# EAGLE design TMotor_Rev0_5_1_Jan30 (EAGLE 9.6.2)

## Sheet 1 of 5: Arduino Nano Sense and Teensy
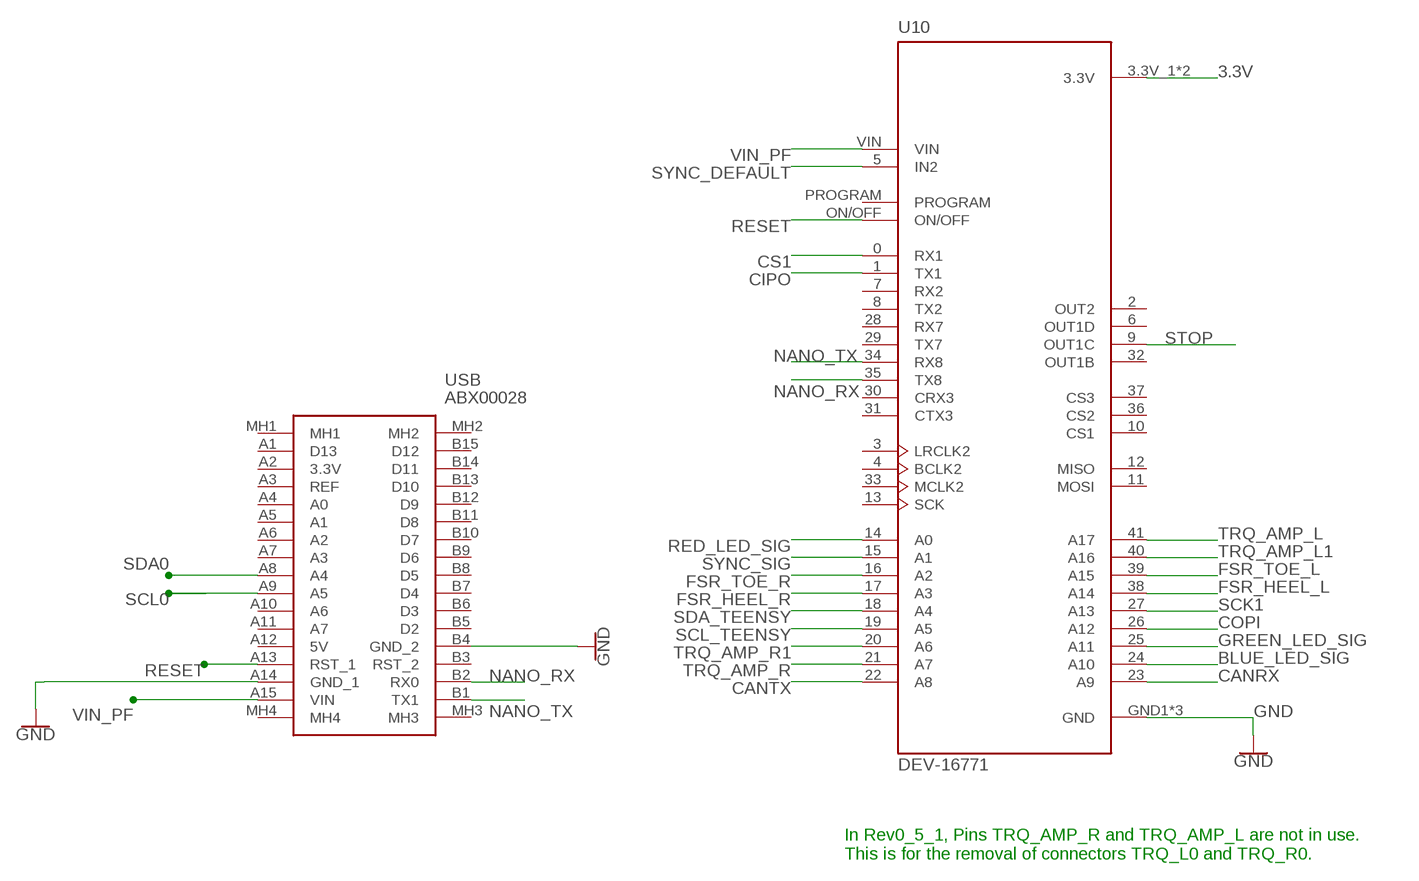
[diagram p0: schematic, sheet 1]

### Parts
U10  DEV-16771  [MODULE_DEV-16771]
USB  ABX00028  [ABX00028]

### Nets
3.3V: U10.3.3V_1(3.3V) U10.3.3V_2(3.3V) ; also sheet 2,4,5
BLUE_LED_SIG: U10.24(A10) ; also sheet 4
CANRX: U10.23(A9) ; also sheet 2
CANTX: U10.22(A8) ; also sheet 2
CIPO: U10.1(TX1) ; also sheet 2
COPI: U10.26(A12) ; also sheet 2
CS1: U10.0(RX1) ; also sheet 2
FSR_HEEL_L: U10.38(A14) ; also sheet 5
FSR_HEEL_R: U10.17(A3) ; also sheet 5
FSR_TOE_L: U10.39(A15) ; also sheet 5
FSR_TOE_R: U10.16(A2) ; also sheet 5
GND: U10.GND1(GND) U10.GND2(GND) U10.GND3(GND) USB.A14(GND_1) USB.B4(GND_2) ; also sheet 2,4,5
GREEN_LED_SIG: U10.25(A11) ; also sheet 4
NANO_RX: U10.35(TX8) USB.B2(RX0)
NANO_TX: U10.34(RX8) USB.B1(TX1)
RED_LED_SIG: U10.14(A0) ; also sheet 4
RESET: U10.ON/OFF USB.A13(RST_1) ; also sheet 2
SCK1: U10.27(A13) ; also sheet 2
SCL0: USB.A9(A5) ; also sheet 2
SCL_TEENSY: U10.19(A5) ; also sheet 2
SDA0: USB.A8(A4) ; also sheet 2
SDA_TEENSY: U10.18(A4) ; also sheet 2
STOP: U10.9(OUT1C) ; also sheet 2
SYNC_DEFAULT: U10.5(IN2) ; also sheet 2
SYNC_SIG: U10.15(A1) ; also sheet 4
TRQ_AMP_L: U10.41(A17)
TRQ_AMP_L1: U10.40(A16) ; also sheet 5
TRQ_AMP_R: U10.21(A7)
TRQ_AMP_R1: U10.20(A6) ; also sheet 5
VIN_PF: U10.VIN USB.A15(VIN) ; also sheet 2
Unconnected: U10.2(OUT2) U10.3(LRCLK2) U10.4(BCLK2) U10.6(OUT1D) U10.7(RX2) U10.8(TX2) U10.10(CS1) U10.11(MOSI) U10.12(MISO) U10.13(SCK) U10.28(RX7) U10.29(TX7) U10.30(CRX3) U10.31(CTX3) U10.32(OUT1B) U10.33(MCLK2) U10.36(CS2) U10.37(CS3) U10.PROGRAM USB.A1(D13) USB.A2(3.3V) USB.A3(REF) USB.A4(A0) USB.A5(A1) USB.A6(A2) USB.A7(A3) USB.A10(A6) USB.A11(A7) USB.A12(5V) USB.B3(RST_2) USB.B5(D2) USB.B6(D3) USB.B7(D4) USB.B8(D5) USB.B9(D6) USB.B10(D7) USB.B11(D8) USB.B12(D9) USB.B13(D10) USB.B14(D11) USB.B15(D12) USB.MH1 USB.MH2 USB.MH3 USB.MH4

### Notes on the sheet
- In Rev0_5_1, Pins TRQ_AMP_R and TRQ_AMP_L are not in use.
  This is for the removal of connectors TRQ_L0 and TRQ_R0.

## Sheet 2 of 5: Motor Drivers & Power
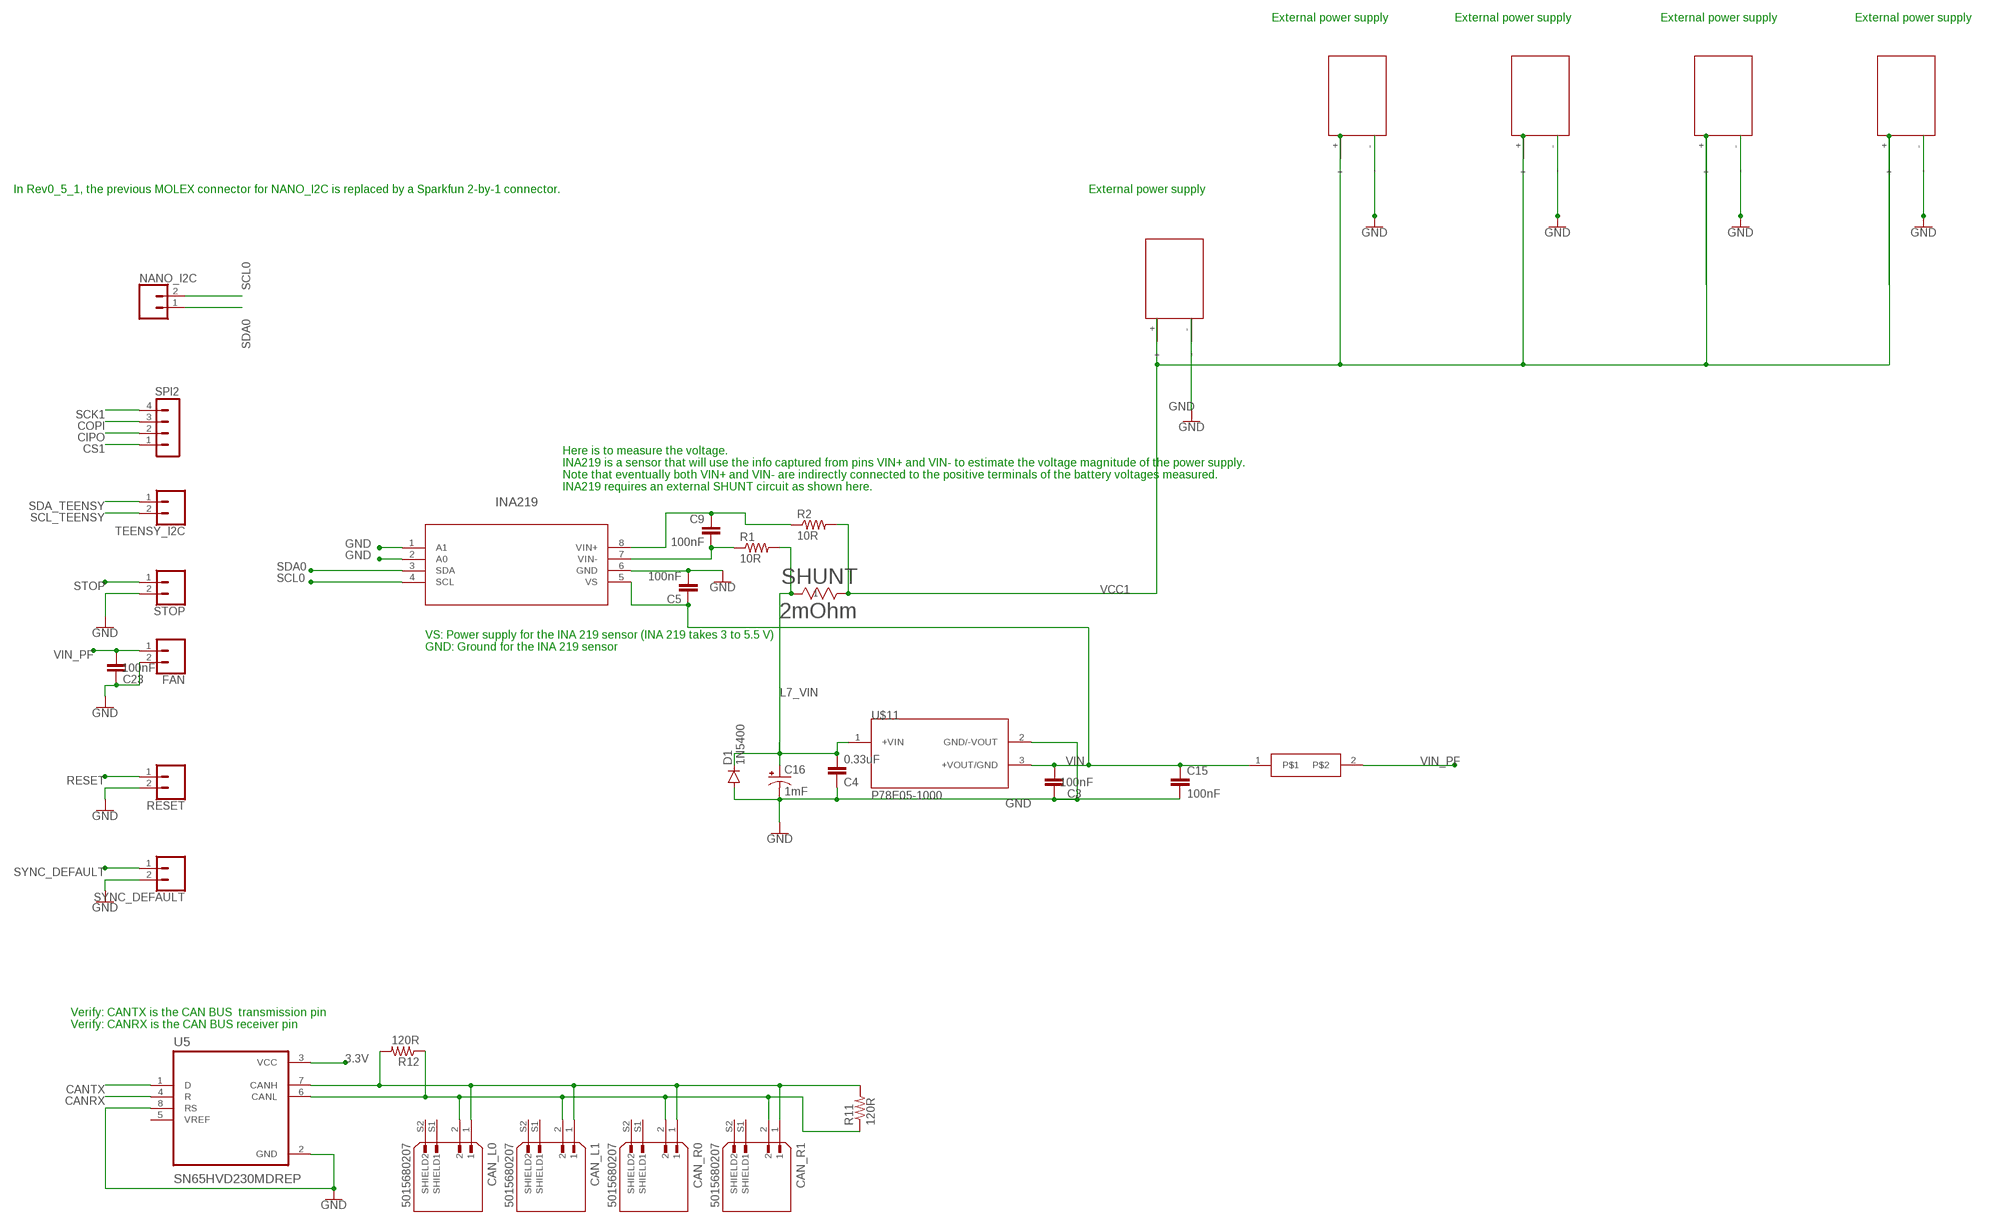
[diagram p1: schematic, sheet 2]

### Parts
C3  100nF  C-EU050-024X044  [C050-024X044]
C4  0.33uF  C-EU050-024X044  [C050-024X044]
C5  100nF  C-EU050-024X044  [C050-024X044]
C9  100nF  C-EU050-024X044  [C050-024X044]
C15  100nF  C-EU050-024X044  [C050-024X044]
C16  1mF  CPOL-USE5-10.5  [E5-10,5]
C23  100nF  C-EU050-024X044  [C050-024X044]
CAN_L0  5015680207  [MOLEX_5015680207]
CAN_L1  5015680207  [MOLEX_5015680207]
CAN_R0  5015680207  [MOLEX_5015680207]
CAN_R1  5015680207  [MOLEX_5015680207]
D1  1N5400  [DO201-15]
FAN  CONN_02  [1X02]
INA219  INA219AIDR  [D8_TEX]
NANO_I2C  CONN_02  [1X02]
R1  10R  R-US_0207/10  [0207/10]
R2  10R  R-US_0207/10  [0207/10]
R11  120R  R-US_0207/10  [0207/10]
R12  120R  R-US_0207/10  [0207/10]
RESET  CONN_02  [1X02]
SHUNT  2mOhm  CSNL2512FT2L00  [STA_CSNL2512(2)_STP]
SPI2  MA04-1  [MA04-1]
STOP  CONN_02  [1X02]
SYNC_DEFAULT  CONN_02  [1X02]
TEENSY_I2C  CONN_02  [1X02]
U5  SN65HVD230MDREP  [SOIC127P599X175-8N]
U$6  0458002.DR  [FUSE_LITTEL_448]
U$11  P78E05-1000  [P78E05-1000]
XT30UPB-F  L_0  XT30UPB-F  [XT30UPB-F]
XT30UPB-F1  L_0  XT30UPB-F  [XT30UPB-F]
XT30UPB-F2  L_0  XT30UPB-F  [XT30UPB-F]
XT30UPB-F3  L_0  XT30UPB-F  [XT30UPB-F]
XT30UPB-F4  L_0  XT30UPB-F  [XT30UPB-F]

### Nets
3.3V: U5.3(VCC) ; also sheet 1,4,5
CANRX: U5.4(R) ; also sheet 1
CANTX: U5.1(D) ; also sheet 1
CIPO: SPI2.2 ; also sheet 1
COPI: SPI2.3 ; also sheet 1
CS1: SPI2.1 ; also sheet 1
GND: C3.1 C4.1 C5.2 C15.2 C16.- C23.1 D1.A FAN.2 INA219.1(A1) INA219.2(A0) INA219.6(GND) RESET.2 STOP.2 SYNC_DEFAULT.2 U5.2(GND) U5.8(RS) U$11.2(GND/-VOUT) XT30UPB-F1.- XT30UPB-F2.- XT30UPB-F3.- XT30UPB-F4.- XT30UPB-F.- ; also sheet 1,4,5
L7_VIN: C4.2 C16.+ D1.C R1.2 SHUNT.1 U$11.1(+VIN)
N$23: C9.1 INA219.8(VIN+) R2.1
N$26: C9.2 INA219.7(VIN-) R1.1
N$44: CAN_L0.1 CAN_L1.1 CAN_R0.1 CAN_R1.1 R11.2 R12.2 U5.7(CANH)
N$45: CAN_L0.2 CAN_L1.2 CAN_R0.2 CAN_R1.2 R11.1 R12.1 U5.6(CANL)
RESET: RESET.1 ; also sheet 1
SCK1: SPI2.4 ; also sheet 1
SCL0: INA219.4(SCL) NANO_I2C.2 ; also sheet 1
SCL_TEENSY: TEENSY_I2C.2 ; also sheet 1
SDA0: INA219.3(SDA) NANO_I2C.1 ; also sheet 1
SDA_TEENSY: TEENSY_I2C.1 ; also sheet 1
STOP: STOP.1 ; also sheet 1
SYNC_DEFAULT: SYNC_DEFAULT.1 ; also sheet 1
VCC1: R2.2 SHUNT.2 XT30UPB-F1.+ XT30UPB-F2.+ XT30UPB-F3.+ XT30UPB-F4.+ XT30UPB-F.+
VIN: C3.2 C5.1 C15.1 INA219.5(VS) U$6.1 U$11.3(+VOUT/GND)
VIN_PF: C23.2 FAN.1 U$6.2 ; also sheet 1
Unconnected: CAN_L0.S1(SHIELD1) CAN_L0.S2(SHIELD2) CAN_L1.S1(SHIELD1) CAN_L1.S2(SHIELD2) CAN_R0.S1(SHIELD1) CAN_R0.S2(SHIELD2) CAN_R1.S1(SHIELD1) CAN_R1.S2(SHIELD2) U5.5(VREF)

### Notes on the sheet
- External power supply | External power supply | External power supply | External power supply
- In Rev0_5_1, the previous MOLEX connector for NANO_I2C is replaced by a Sparkfun 2-by-1 connector. | External power supply
- Here is to measure the voltage.
  INA219 is a sensor that will use the info captured from pins VIN+ and VIN- to estimate the voltage magnitude of the power supply.
  Note that eventually both VIN+ and VIN- are indirectly connected to the positive terminals of the battery voltages measured.
  INA219 requires an external SHUNT circuit as shown here.
- VS: Power supply for the INA 219 sensor (INA 219 takes 3 to 5.5 V)
  GND: Ground for the INA 219 sensor
- Verify: CANTX is the CAN BUS  transmission pin
  Verify: CANRX is the CAN BUS receiver pin

## Sheet 3 of 5: FSRs filters
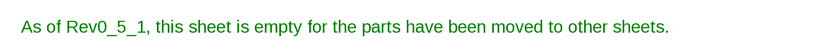
[diagram p2: schematic, sheet 3]

### Notes on the sheet
- As of Rev0_5_1, this sheet is empty for the parts have been moved to other sheets.

## Sheet 4 of 5: LED
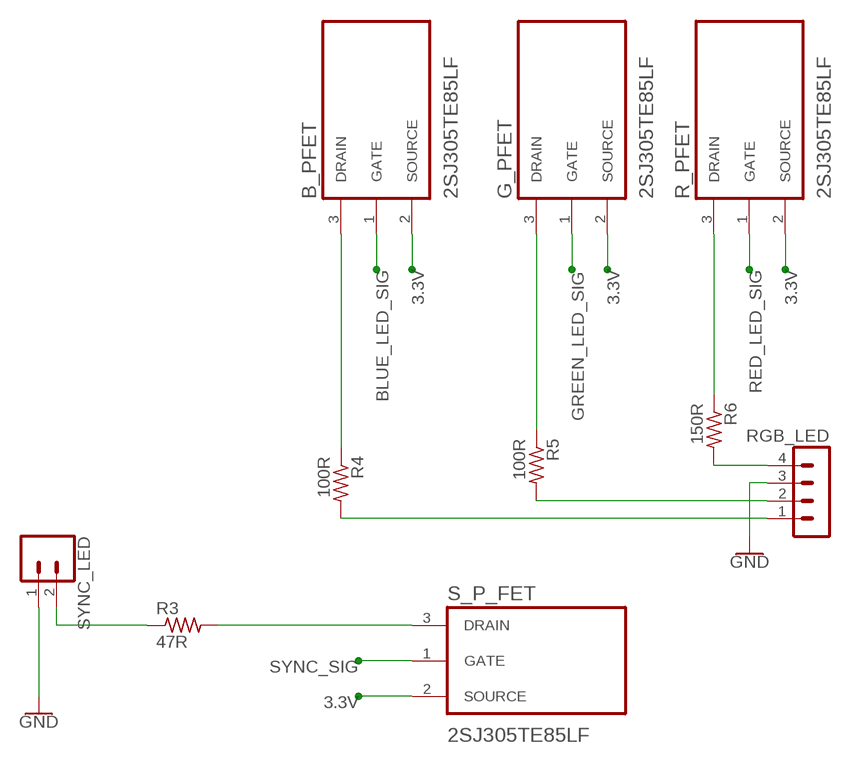
[diagram p3: schematic, sheet 4]

### Parts
B_PFET  2SJ305TE85LF  [TRANS_SSM3J325F,LF]
G_PFET  2SJ305TE85LF  [TRANS_SSM3J325F,LF]
R3  47R  R-US_0207/10  [0207/10]
R4  100R  R-US_0207/10  [0207/10]
R5  100R  R-US_0207/10  [0207/10]
R6  150R  R-US_0207/10  [0207/10]
R_PFET  2SJ305TE85LF  [TRANS_SSM3J325F,LF]
RGB_LED  MA04-1  [MA04-1]
S_P_FET  2SJ305TE85LF  [TRANS_SSM3J325F,LF]
SYNC_LED  CONN_02  [1X02]

### Nets
3.3V: B_PFET.2(SOURCE) G_PFET.2(SOURCE) R_PFET.2(SOURCE) S_P_FET.2(SOURCE) ; also sheet 1,2,5
BLUE_LED_SIG: B_PFET.1(GATE) ; also sheet 1
GND: RGB_LED.3 SYNC_LED.1 ; also sheet 1,2,5
GREEN_LED_SIG: G_PFET.1(GATE) ; also sheet 1
N$1: R4.2 RGB_LED.1
N$2: B_PFET.3(DRAIN) R4.1
N$17: R3.2 S_P_FET.3(DRAIN)
N$18: R3.1 SYNC_LED.2
N$24: R6.2 RGB_LED.4
N$25: R5.2 RGB_LED.2
N$30: G_PFET.3(DRAIN) R5.1
N$31: R6.1 R_PFET.3(DRAIN)
RED_LED_SIG: R_PFET.1(GATE) ; also sheet 1
SYNC_SIG: S_P_FET.1(GATE) ; also sheet 1

## Sheet 5 of 5: Bluetooth
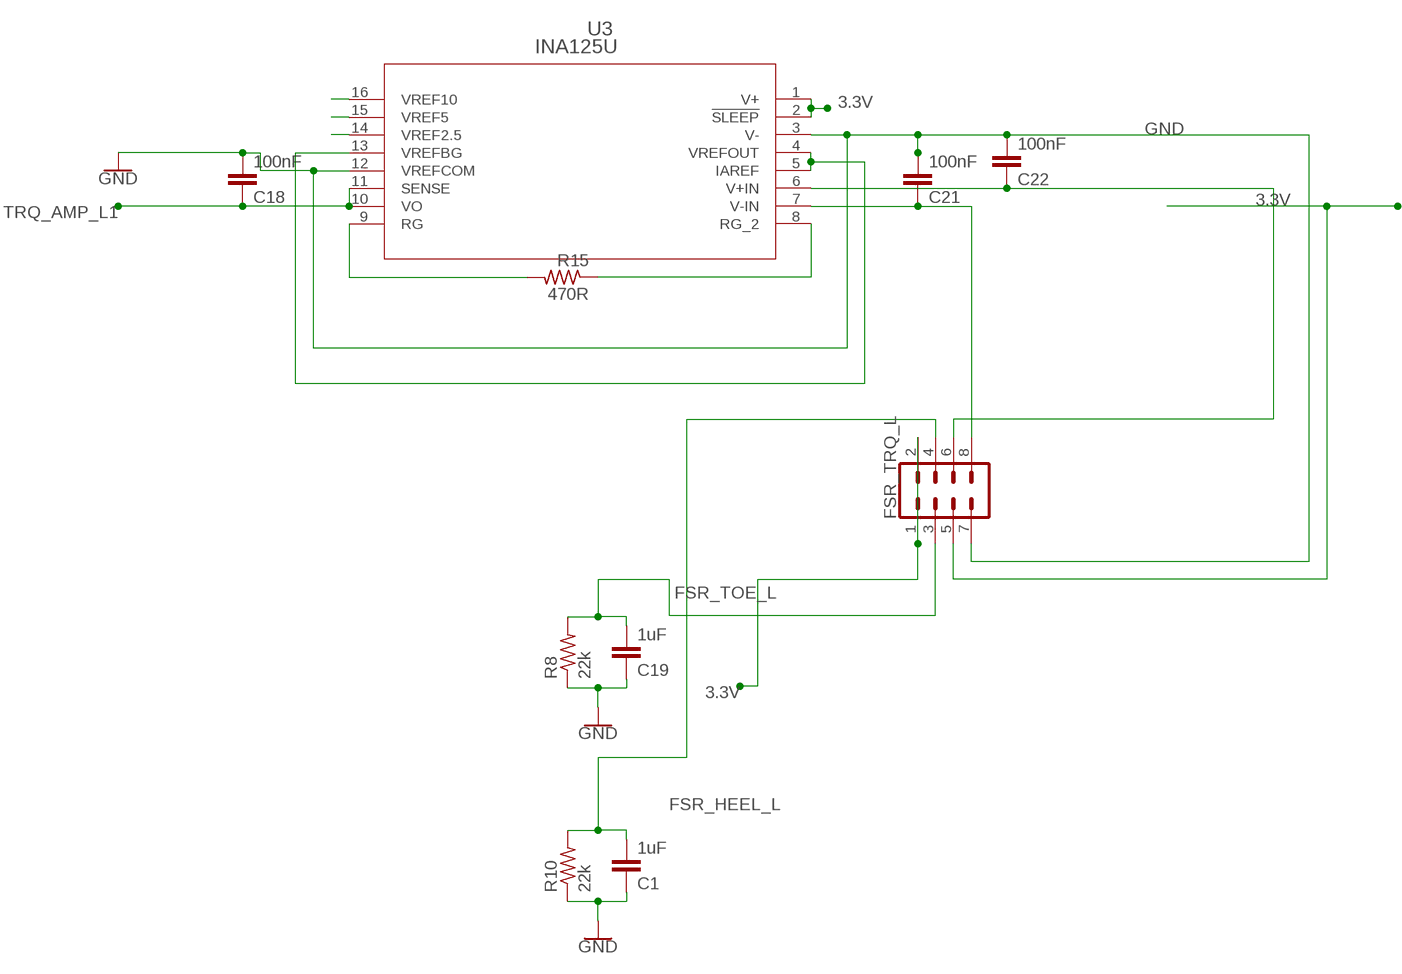
[diagram p4: schematic, sheet 5, part 1 of 2]
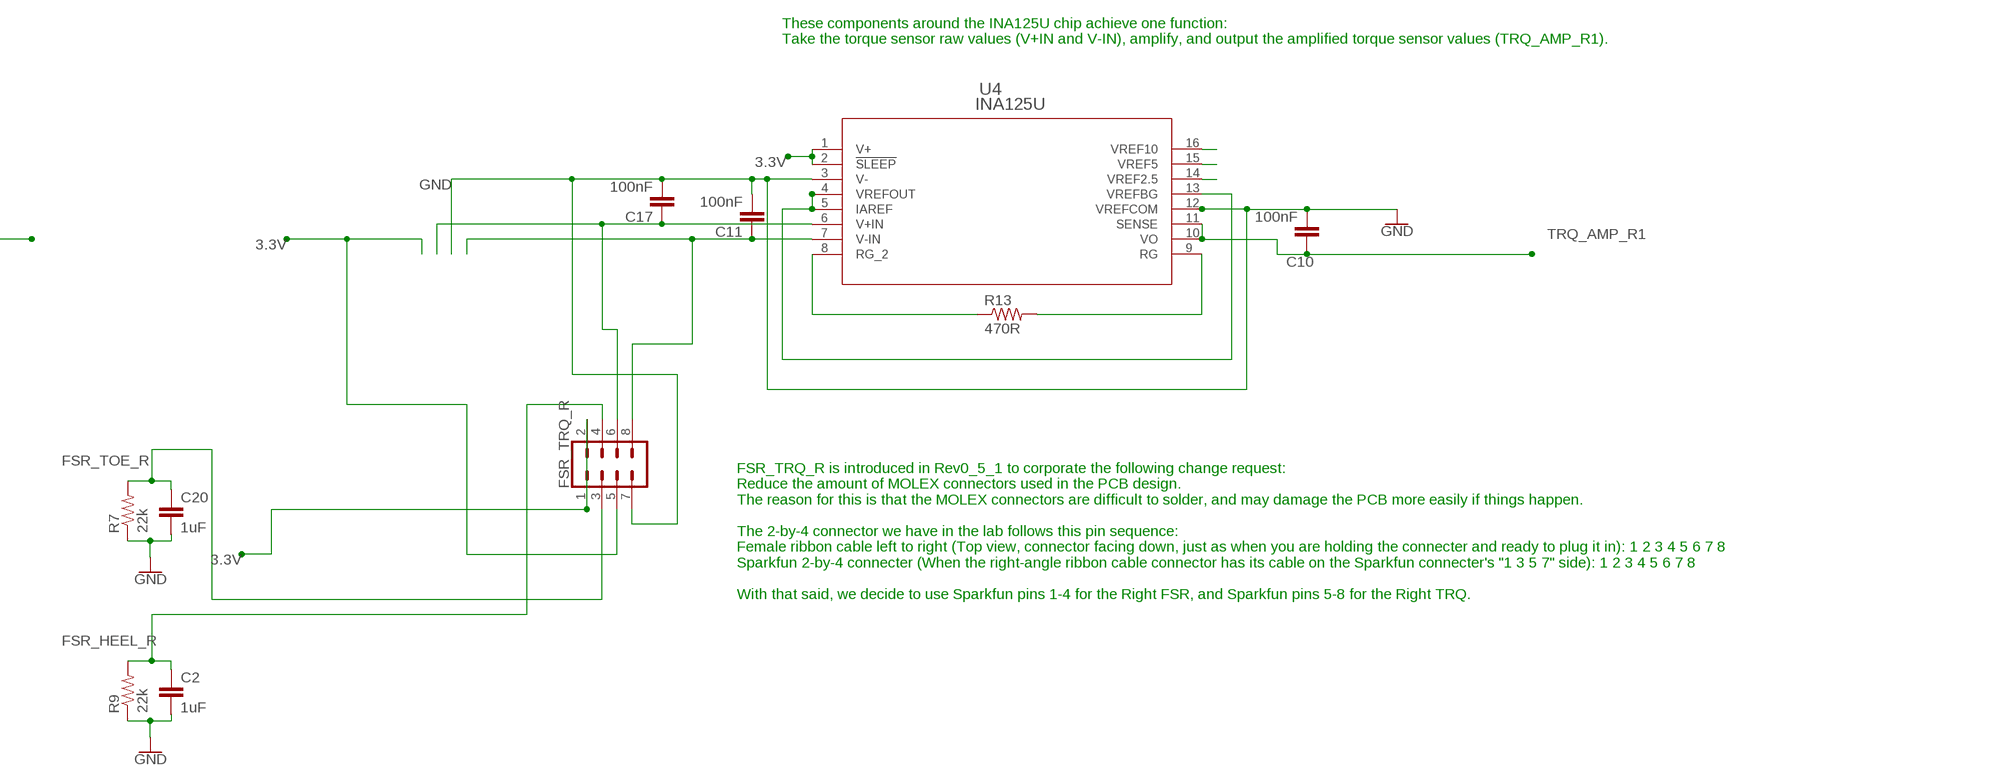
[diagram p5: schematic, sheet 5, part 2 of 2]

### Parts
C1  1uF  C-EU050-024X044  [C050-024X044]
C2  1uF  C-EU050-024X044  [C050-024X044]
C10  100nF  C-EU050-024X044  [C050-024X044]
C11  100nF  C-EU050-024X044  [C050-024X044]
C17  100nF  C-EU050-024X044  [C050-024X044]
C18  100nF  C-EU050-024X044  [C050-024X044]
C19  1uF  C-EU050-024X044  [C050-024X044]
C20  1uF  C-EU050-024X044  [C050-024X044]
C21  100nF  C-EU050-024X044  [C050-024X044]
C22  100nF  C-EU050-024X044  [C050-024X044]
FSR_TRQ_L  CONN_04X2  [2X4]
FSR_TRQ_R  CONN_04X2  [2X4]
R7  22k  R-US_0207/10  [0207/10]
R8  22k  R-US_0207/10  [0207/10]
R9  22k  R-US_0207/10  [0207/10]
R10  22k  R-US_0207/10  [0207/10]
R13  470R  R-US_0207/10  [0207/10]
R15  470R  R-US_0207/10  [0207/10]
U3  INA125U  [D16]
U4  INA125U  [D16]

### Nets
3.3V: FSR_TRQ_L.1 FSR_TRQ_L.2 FSR_TRQ_L.5 FSR_TRQ_R.1 FSR_TRQ_R.2 FSR_TRQ_R.5 U3.1(V+) U3.2(!SLEEP) U4.1(V+) U4.2(!SLEEP) ; also sheet 1,2,4
FSR_HEEL_L: C1.2 FSR_TRQ_L.4 R10.2 ; also sheet 1
FSR_HEEL_R: C2.1 FSR_TRQ_R.4 R9.2 ; also sheet 1
FSR_TOE_L: C19.2 FSR_TRQ_L.3 R8.2 ; also sheet 1
FSR_TOE_R: C20.1 FSR_TRQ_R.3 R7.2 ; also sheet 1
GND: C1.1 C2.2 C10.2 C11.2 C17.2 C18.2 C19.1 C20.2 C21.2 C22.2 FSR_TRQ_L.7 FSR_TRQ_R.7 R7.1 R8.1 R9.1 R10.1 U3.3(V-) U3.12(VREFCOM) U4.3(V-) U4.12(VREFCOM) ; also sheet 1,2,4
N$4: U4.16(VREF10)
N$14: U4.15(VREF5)
N$15: U4.4(VREFOUT) U4.5(IAREF) U4.13(VREFBG)
N$16: R13.1 U4.8(RG_2)
N$19: U4.14(VREF2.5)
N$27: R13.2 U4.9(RG)
N$28: C17.1 FSR_TRQ_R.6 U4.6(V+IN)
N$29: C11.1 FSR_TRQ_R.8 U4.7(V-IN)
N$32: U3.4(VREFOUT) U3.5(IAREF) U3.13(VREFBG)
N$33: C22.1 FSR_TRQ_L.6 U3.6(V+IN)
N$34: C21.1 FSR_TRQ_L.8 U3.7(V-IN)
N$35: R15.2 U3.9(RG)
N$36: R15.1 U3.8(RG_2)
N$40: U3.16(VREF10)
N$41: U3.15(VREF5)
N$42: U3.14(VREF2.5)
TRQ_AMP_L1: C18.1 U3.10(VO) U3.11(SENSE) ; also sheet 1
TRQ_AMP_R1: C10.1 U4.10(VO) U4.11(SENSE) ; also sheet 1

### Notes on the sheet
- These components around the INA125U chip achieve one function:
  Take the torque sensor raw values (V+IN and V-IN), amplify, and output the amplified torque sensor values (TRQ_AMP_R1).
- FSR_TRQ_R is introduced in Rev0_5_1 to corporate the following change request:
  Reduce the amount of MOLEX connectors used in the PCB design. 
  The reason for this is that the MOLEX connectors are difficult to solder, and may damage the PCB more easily if things happen.
  
  The 2-by-4 connector we have in the lab follows this pin sequence:
  Female ribbon cable left to right (Top view, connector facing down, just as when you are holding the connecter and ready to plug it in): 1 2 3 4 5 6 7 8
  Sparkfun 2-by-4 connecter (When the right-angle ribbon cable connector has its cable on the Sparkfun connecter's "1 3 5 7" side): 1 2 3 4 5 6 7 8
  
  With that said, we decide to use Sparkfun pins 1-4 for the Right FSR, and Sparkfun pins 5-8 for the Right TRQ.

## Library data of the parts
B_PFET G_PFET R_PFET S_P_FET = 2SJ305TE85LF:2SJ305TE85LF: None Check prices <https://pricing.snapeda.com/parts/2SJ305TE85LF/Toshiba/view-part?ref=eda>; AVAILABILITY: In Stock; DESCRIPTION: P-Channel 30V 200mA (Ta) 200mW (Ta) Surface Mount SC-59; MF: Toshiba; MP: 2SJ305TE85LF; PACKAGE: SC-59 Toshiba; PRICE: None; PURCHASE-URL: https://pricing.snapeda.com/search/part/2SJ305TE85LF/?ref=eda
C1-C5 C9-C11 C15 C17-C23 = rcl:C-EU: CAPACITOR, European symbol; SPICEPREFIX: C
C16 = rcl:CPOL-US: POLARIZED CAPACITOR, American symbol; SPICEPREFIX: C
CAN_L0 CAN_L1 CAN_R0 CAN_R1 = SnapEDA-Library:5015680207; MANUFACTURER: Molex; MAXIMUM_PACKAGE_HEIGHT: 3.2 mm; PARTREV: A; STANDARD: Manufacturer Recommendations
D1 = diode:1N5400: DIODE standard rectifier, 3 A, 50 V (Motorola)
FAN NANO_I2C RESET STOP SYNC_DEFAULT SYNC_LED TEENSY_I2C = SparkFun-Connectors:CONN_02: Multi connection point. Often used as Generic Header-pin footprint for 0.1 inch spaced/style header connections On any of the 0.1 inch spaced packages, you can populate with these: Break Away Headers - Straight <https://www.sparkfun.com/products/116> (PRT-00116) Break Away Male Headers - Right Angle <https://www.sparkfun.com/products/553> (PRT-00553) Female Headers <https://www.sparkfun.com/products/115> (PRT-00115) Break Away Headers - Machine Pin <https://www.sparkfun.com/products/117> (PRT-00117) Break Away Female Headers - Swiss Machine Pin <https://www.sparkfun.com/products/743> (PRT-00743) For SCREWTERMINALS and SPRING TERMINALS visit here: Screw Terimnals on SparkFun.com <https://www.sparkfun.com/search/results?term=Screw+Terminals> (5mm/3.5mm/2.54mm spacing) This device is also useful as a general connection point to wire up your design to another part of your project. Our various solder wires solder well into these plated through hole pads. Hook-Up Wire - Assortment (Stranded, 22 AWG) <https://www.sparkfun.com/products/11375> (PRT-11375) Hook-Up Wire - Assortment (Solid Core, 22 AWG) <https://www.sparkfun.com/products/11367> (PRT-11367) View the entire wire category on our website here <https://www.sparkfun.com/categories/141> Special notes: Molex polarized connector foot print use with: PRT-08233 with associated crimp pins and housings. 2.54_SCREWTERM for use with PRT-10571. 3.5mm Screw Terminal footprints for PRT-08084 5mm Screw Terminal footprints for use with PRT-08432
FSR_TRQ_L FSR_TRQ_R = SparkFun-Connectors:CONN_04X2: Multi connection point. Often used as Generic Header-pin footprint for 0.1 inch spaced/style header connections On any of the 0.1 inch spaced packages, you can populate with these: Break Away Headers - Straight <https://www.sparkfun.com/products/116> (PRT-00116) Break Away Male Headers - Right Angle <https://www.sparkfun.com/products/553> (PRT-00553) Female Headers <https://www.sparkfun.com/products/115> (PRT-00115) Break Away Headers - Machine Pin <https://www.sparkfun.com/products/117> (PRT-00117) Break Away Female Headers - Swiss Machine Pin <https://www.sparkfun.com/products/743> (PRT-00743)
INA219 = INA219:INA219AIDR; BUILT_BY: EMA_UL_Team; MANUFACTURER_PART_NUMBER: INA219AIDR; SOURCELIBRARY: TI_2015-1-5; VENDOR: Texas Instruments
R1-R6 R11-R13 R15 = rcl:R-US_: RESISTOR, American symbol; SPICEPREFIX: R
R7-R10 = resistor:R-US_: RESISTOR, American symbol
RGB_LED SPI2 = con-lstb:MA04-1: PIN HEADER; OC_FARNELL: unknown; OC_NEWARK: unknown
SHUNT = ShuntResistor:CSNL2512FT2L00; BUILT_BY: EMA_UL_Team; MANUFACTURER_PART_NUMBER: CSNL2512FT2L00; SOURCELIBRARY: Stackpole_2014-12-31; VENDOR: Stackpole International
U3 U4 = Digikey:INA125U; DATASHEET_URL: http://www.ti.com/lit/gpn/INA125; DESCRIPTION: Instrumentation Amplifier with Precision Voltage Reference; FAMILY_NAME: SINGLE SUPPLY; GENERIC_PART_NUMBER: INA125; INDUSTRY_STD_PKG_TYPE: SOIC; MANUFACTURER: Texas Instruments; MANUFACTURER_PART_NUMBER: INA125U; PACKAGE_DESIGNATOR: D; PIN_COUNT: 16; VENDOR: Texas Instruments
U5 = SnapEDA-Library:SN65HVD230MDREP
U10 = SnapEDA-Library:DEV-16771: RT1062 Teensy 4.1 i.MX ARM Cortex-M7 MPU Embedded Evaluation Board; MANUFACTURER: SparkFun Electronics; MAXIMUM_PACKAGE_HEIGHT: 4.07mm; PARTREV: 4.1; STANDARD: Manufacturer recommendations
U$6 = SnapEDA-Library (1):0458002.DR: 0448002.MR Digi-Key Part Number - F1638TR-ND - Tape & Reel (TR) - F1638CT-ND - Cut Tape (CT) - F1638DKR-ND - Digi-Reel® Manufacturer - Littelfuse Inc. Manufacturer Product Number - 0448002.MR Description - FUSE BOARD MNT 2A 125VAC/VDC SMD
U$11 = SnapEDA-Library_Paul:P78E05-1000: Digikey 102-5018-ND Non-Isolated PoL Module DC DC Converter 1 Output 5V 1A 8V - 36V Input
USB = ABX00028:ABX00028: Development Boards & Kits - AVR Arduino Nano Every Source: Datasheet <https://store.arduino.cc/arduino-nano-every>; ARROW_PART_NUMBER: ABX00028; ARROW_PRICE-STOCK: https://www.arrow.com/en/products/abx00028/arduino-corporation; DESCRIPTION: Development Boards & Kits - AVR Arduino Nano Every; HEIGHT: 10mm; MANUFACTURER_NAME: Arduino; MANUFACTURER_PART_NUMBER: ABX00028; MOUSER_PART_NUMBER: 782-ABX00028; MOUSER_PRICE-STOCK: https://www.mouser.co.uk/ProductDetail/Arduino/ABX00028/?qs=PzGy0jfpSMtit6rnFl8mVg%3D%3D
XT30UPB-F XT30UPB-F1-XT30UPB-F4 = XT30UPB-F:XT30UPB-F: XT30 PCB Mount Upright Female Power Connector. 15A cont. 30A burst.

## Board
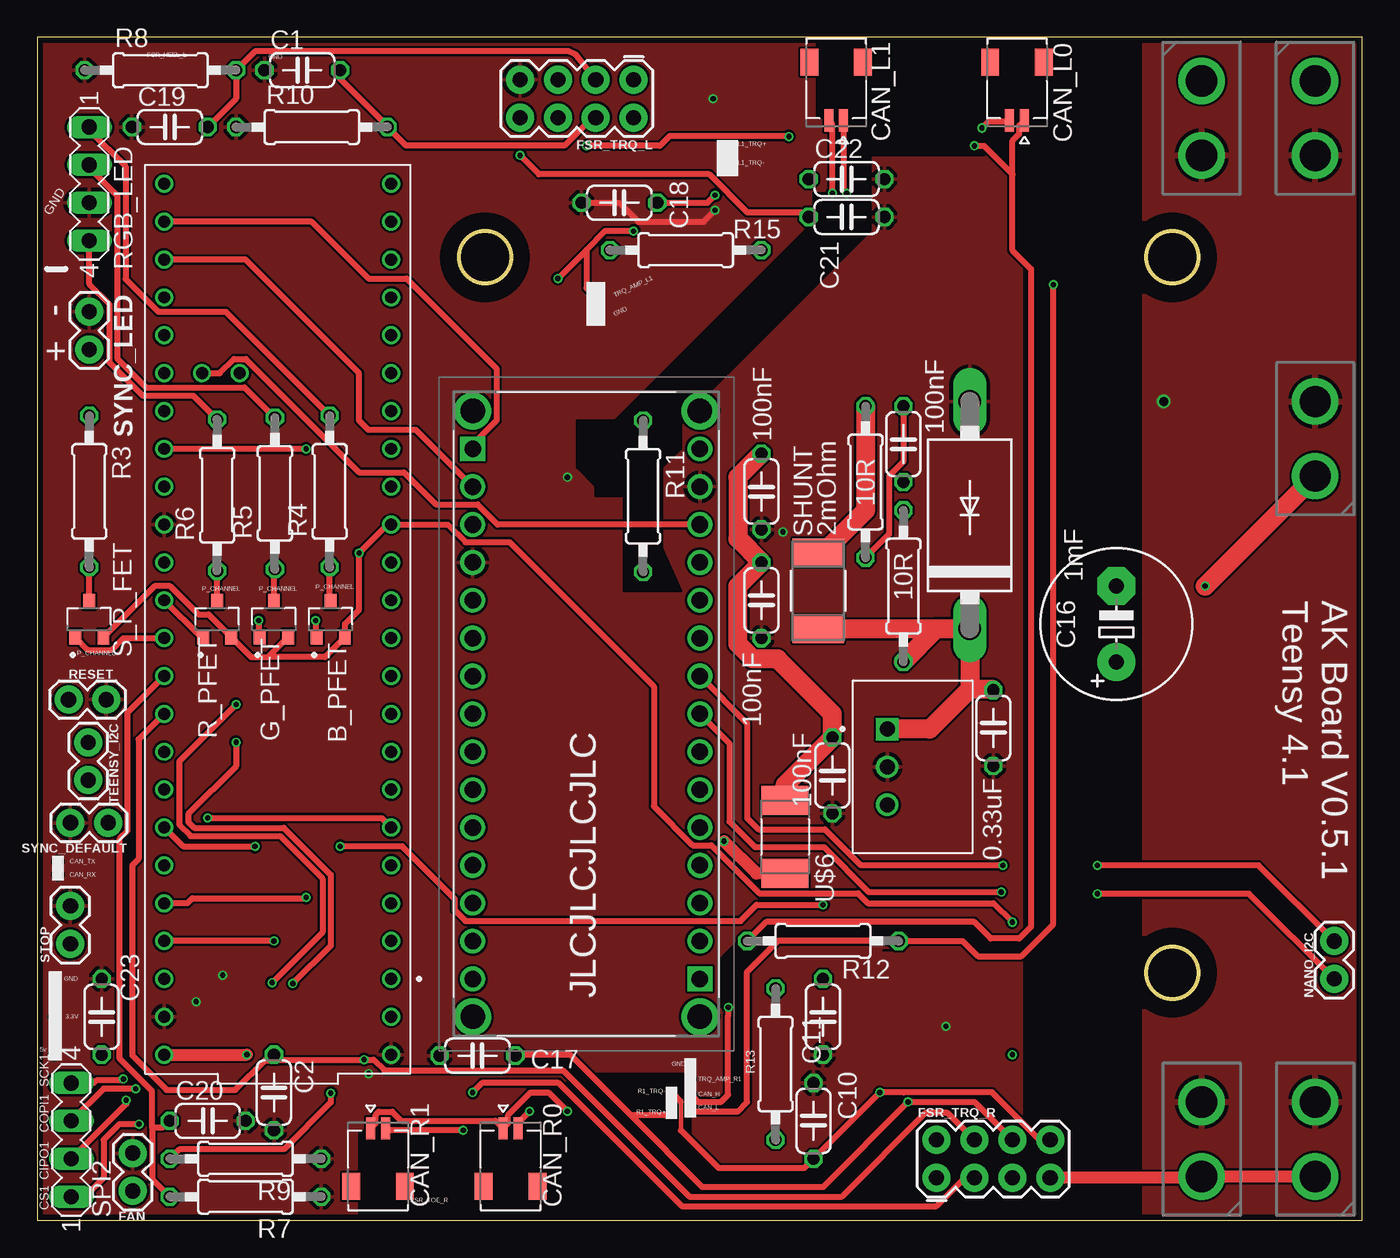
[diagram p6: board, top side]
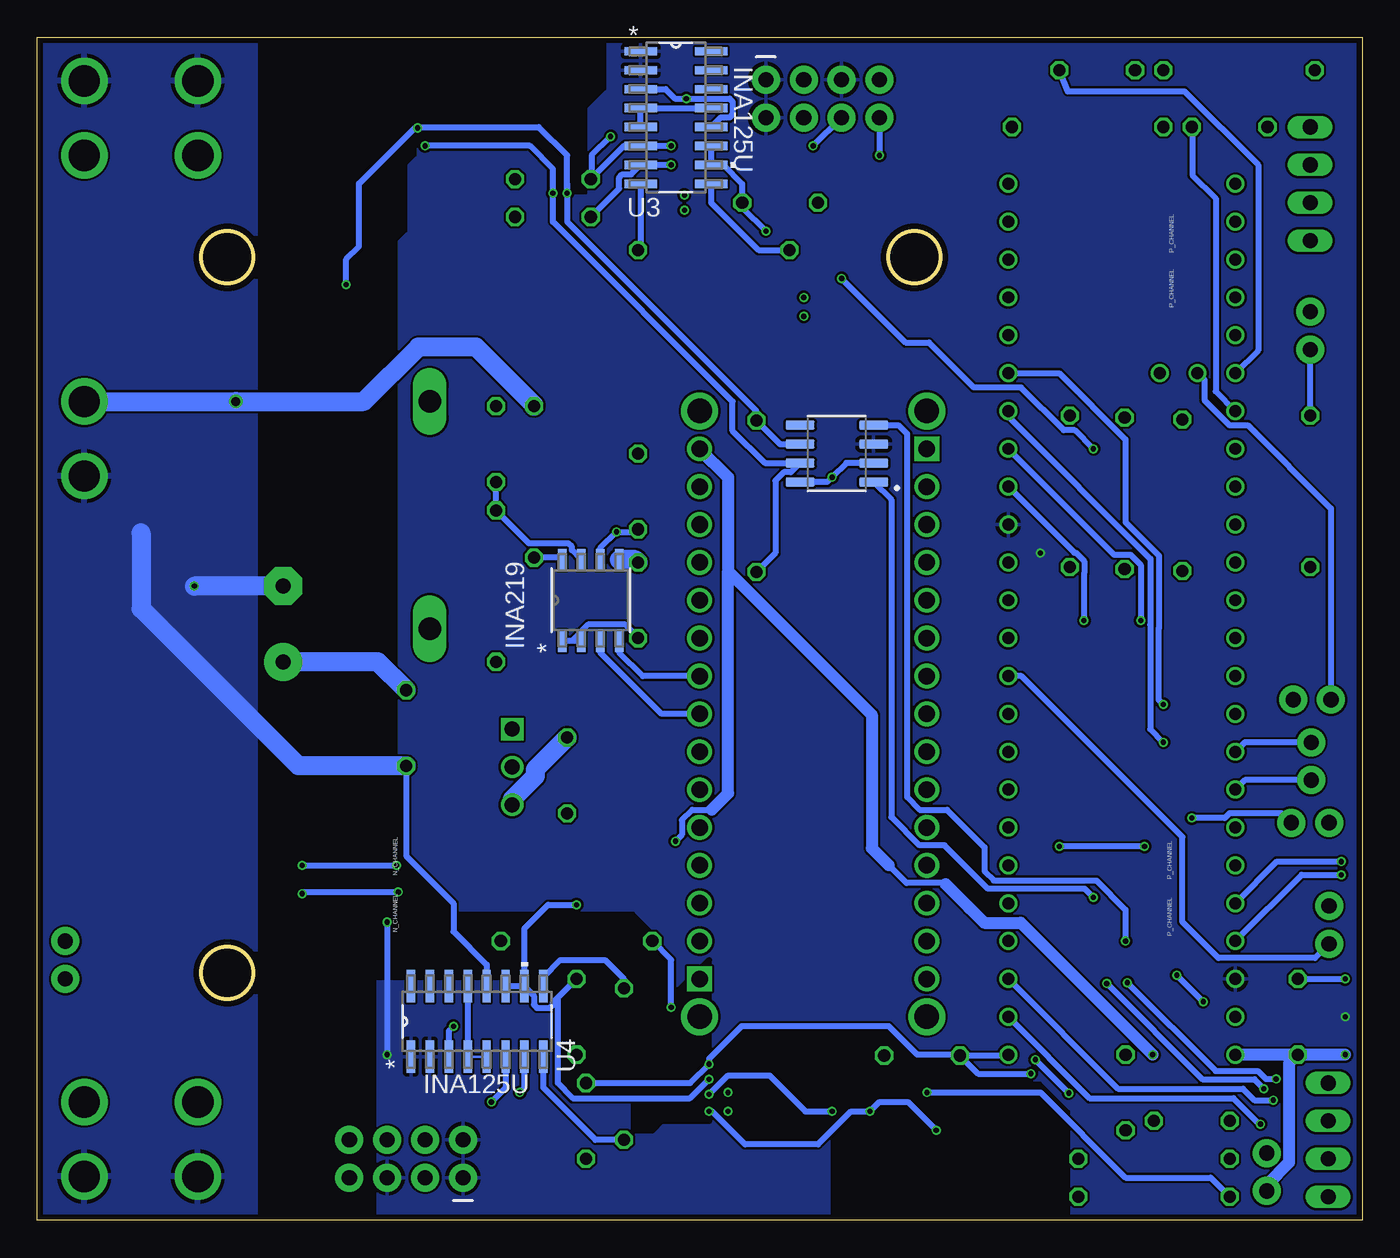
[diagram p7: board, bottom side, seen from below]

Size 88.88 x 79.36 mm. Coordinates in mm from the lower left corner, seen from the top.
Outline: 0,0 88.88,0 88.88,79.36 0,79.36 0,0
Outline: circle at 30.04,64.6 radius 1.75
Outline: circle at 76.13,64.6 radius 1.75
Outline: circle at 76.13,16.6 radius 1.75
Copper layers (1*16): Top 0.035559375mm / dielectric 1.6mm / Bottom 0.035559375mm
Design rules "oshpark-2layer": minimum track width 6mil, minimum drill 10mil, track to track 6mil, track to pad 6mil, pad to pad 6mil, via to via 6mil, smd to smd 6mil, copper to edge 15mil, drill to drill 6mil, minimum pad ring 5mil, minimum via ring 5mil, stop-mask expansion 2.5mil, vias tented up to drill 0mil, thermal gap 10mil
tRestrict: area 56.8,18.1 to 58.2,18.1; area 73.1,61.6 to 79.1,67.6; area 73.1,13.6 to 79.1,19.6; area 27,61.6 to 33,67.6; area 37.5,42.2 to 43.2,53.7; area 35.6,4.1 to 43.8,9.8; area 36.2,42.2 to 55.9,68.9; area 54,68.9 to 63.5,74; area 63.5,62.6 to 69.2,74; area 45.7,14.3 to 48.3,18.7
bRestrict: area 19.7,0.3 to 35.6,9.8; area 43.8,6 to 48.9,17.5; area 50.8,68.9 to 56.5,79.1; area 47,12.4 to 69.2,79.1; area 47,12.4 to 48.9,14.3

### Footprints (pad centres in the part's own frame; a part is rotated, then mirrored left to right if it is on the bottom)
TRANS_SSM3J325F,LF = smd 1 x 0.8: 1 -1.2,0.95; 2 -1.2,-0.95; 3 1.2,0
C050-024X044 = drill 0.813 octagon: 1 -2.54,0; 2 2.54,0
E5-10,5 = drill 1.016 pad 2.54: + -2.54,0 | drill 1.016 pad 2.54 octagon: - 2.54,0
MOLEX_5015680207 = smd 0.6 x 1.5: 1 -0.5,2.55; 2 0.5,2.55 | smd 1.2 x 1.8: S1 1.8,-1.35; S2 -1.8,-1.35
DO201-15 = drill 1.499 long: A 7.62,0; C -7.62,0
1X02 = drill 1.016 pad 1.88: 1 0,0; 2 2.54,0
2X4 = drill 1.016 pad 1.88: 1 -3.81,-1.27; 2 -3.81,1.27; 3 -1.27,-1.27; 4 -1.27,1.27; 5 1.27,-1.27; 6 1.27,1.27; 7 3.81,-1.27; 8 3.81,1.27
D8_TEX = smd 1.46 x 0.559: 1 -2.724,1.905; 2 -2.724,0.635; 3 -2.724,-0.635; 4 -2.724,-1.905; 5 2.724,-1.905; 6 2.724,-0.635; 7 2.724,0.635; 8 2.724,1.905
0207/10 = drill 0.813 octagon: 1 -5.08,0; 2 5.08,0
MA04-1 = drill 1.016 long: 1 -3.81,0; 2 -1.27,0; 3 1.27,0; 4 3.81,0
STA_CSNL2512(2)_STP = smd 1.88 x 3.429: 1 -2.565,0; 2 2.565,0
D16 = smd 2.184 x 0.559: 1 -2.362,4.445; 2 -2.362,3.175; 3 -2.362,1.905; 4 -2.362,0.635; 5 -2.362,-0.635; 6 -2.362,-1.905; 7 -2.362,-3.175; 8 -2.362,-4.445; 9 2.362,-4.445; 10 2.362,-3.175; 11 2.362,-1.905; 12 2.362,-0.635; 13 2.362,0.635; 14 2.362,1.905; 15 2.362,3.175; 16 2.362,4.445
SOIC127P599X175-8N = smd 1.97 x 0.6: 1 -2.47,1.905; 2 -2.47,0.635; 3 -2.47,-0.635; 4 -2.47,-1.905; 5 2.47,-1.905; 6 2.47,-0.635; 7 2.47,0.635; 8 2.47,1.905
MODULE_DEV-16771 = drill 0.8: 0 -26.67,-7.62; 1 -24.13,-7.62; 2 -21.59,-7.62; 3 -19.05,-7.62; 3.3V_1 6.35,-7.62; 3.3V_2 -24.13,7.62; 4 -16.51,-7.62; 5 -13.97,-7.62; 6 -11.43,-7.62; 7 -8.89,-7.62; 8 -6.35,-7.62; 9 -3.81,-7.62; 10 -1.27,-7.62; 11 1.27,-7.62; 12 3.81,-7.62; 13 3.81,7.62; 14 1.27,7.62; 15 -1.27,7.62; 16 -3.81,7.62; 17 -6.35,7.62; 18 -8.89,7.62; 19 -11.43,7.62; 20 -13.97,7.62; 21 -16.51,7.62; 22 -19.05,7.62; 23 -21.59,7.62; 24 8.89,-7.62; 25 11.43,-7.62; 26 13.97,-7.62; 27 16.51,-7.62; 28 19.05,-7.62; 29 21.59,-7.62; 30 24.13,-7.62; 31 26.67,-7.62; 32 29.21,-7.62; 33 29.21,7.62; 34 26.67,7.62; 35 24.13,7.62; 36 21.59,7.62; 37 19.05,7.62; 38 16.51,7.62; 39 13.97,7.62; 40 11.43,7.62; 41 8.89,7.62; GND1 -29.21,-7.62; GND2 6.35,7.62; GND3 -26.67,7.62; ON/OFF 16.51,5.08; PROGRAM 16.51,2.54; VIN -29.21,7.62
FUSE_LITTEL_448 = smd 1.956 x 3.15: 1 -2.451,0; 2 2.451,0
P78E05-1000 = drill 1 square: 1 -2.54,-2.54 | drill 1: 2 0,-2.54; 3 2.54,-2.54
ABX00028 = drill 1.11 pad 1.665 square: A1 0,0; B1 35.56,15.24 | drill 1.11 pad 1.665: A2 2.54,0; A3 5.08,0; A4 7.62,0; A5 10.16,0; A6 12.7,0; A7 15.24,0; A8 17.78,0; A9 20.32,0; A10 22.86,0; A11 25.4,0; A12 27.94,0; A13 30.48,0; A14 33.02,0; A15 35.56,0; B2 33.02,15.24; B3 30.48,15.24; B4 27.94,15.24; B5 25.4,15.24; B6 22.86,15.24; B7 20.32,15.24; B8 17.78,15.24; B9 15.24,15.24; B10 12.7,15.24; B11 10.16,15.24; B12 7.62,15.24; B13 5.08,15.24; B14 2.54,15.24; B15 0,15.24 | drill 1.65 pad 2.475: MH1 -2.54,0; MH2 -2.54,15.24; MH3 38.1,15.24; MH4 38.1,0
XT30UPB-F = drill 2.1: + 0,0; - 5,0

### Placement (x,y rotation side)
B_PFET  19.69,40.33 90 top
C1  17.78,77.16 0 top
C2  15.88,8.58 270 top
C3  48.58,41.59 90 top
C4  64.14,33.02 90 top
C5  53.34,29.85 270 top
C9  58.1,52.07 270 top
C10  52.7,13.65 270 top
C11  52.07,6.67 90 top
C15  48.58,48.9 270 top
C16  72.39,40.01 90 top
C17  29.53,11.05 180 top
C18  39.05,68.27 180 top
C19  8.89,73.34 0 top
C20  11.43,6.67 0 top
C21  54.29,67.31 0 top
C22  54.29,69.85 0 top
C23  4.32,13.65 270 top
CAN_L0  65.72,76.33 180 top
CAN_L1  53.59,76.33 180 top
CAN_R0  31.75,3.63 0 top
CAN_R1  22.86,3.63 0 top
D1  62.55,47.31 90 top
FAN  6.41,1.97 90 top
FSR_TRQ_L  36.2,75.25 180 top
FSR_TRQ_R  64.14,4.13 0 top
G_PFET  15.88,40.33 90 top
INA219  51.75,41.59 90 bottom
NANO_I2C  87,16.2 90 top
R1  58.1,42.55 270 top
R2  55.56,49.53 90 top
R3  3.49,48.9 270 top
R4  19.62,48.9 90 top
R5  15.94,48.77 90 top
R6  12.07,48.64 90 top
R7  13.97,1.59 180 top
R8  8.26,77.16 0 top
R9  13.97,4.13 180 top
R10  18.41,73.34 0 top
R11  40.64,48.58 270 top
R12  52.7,18.73 180 top
R13  49.53,10.48 90 top
R15  43.5,65.09 180 top
R_PFET  12.07,40.33 90 top
RESET  2.1,34.93 0 top
RGB_LED  3.49,69.53 270 top
S_P_FET  3.49,40.33 90 top
SHUNT  52.39,42.23 90 top
SPI2  2.29,5.4 90 top
STOP  2.22,18.54 90 top
SYNC_DEFAULT  4.76,26.67 180 top
SYNC_LED  3.49,60.96 270 top
TEENSY_I2C  3.43,32.07 270 top
U3  46.04,73.98 0 bottom
U4  59.37,13.34 90 bottom
U5  35.24,51.44 180 bottom
U10  16.13,40.33 90 top
U$6  50.17,25.72 270 top
U$11  59.56,30.42 270 top
USB  44.45,16.2 90 top
XT30UPB-F  78.11,71.44 90 top
XT30UPB-F1  85.72,71.44 90 top
XT30UPB-F2  78.11,7.94 270 top
XT30UPB-F3  85.72,7.94 270 top
XT30UPB-F4  85.72,54.93 270 top

### Tracks (layer width: path | path; a pad name or v marks a point on that pad's centre or on a via)
3.3V  (via drill 0.35)
  Top 0.406: S_P_FET.2 7.87,42.55 8.91,42.55 10.81,40.64 11.5,40.64 R_PFET.2 14.36,37.79 15.48,37.79 | 15.48,37.79 G_PFET.2 | 15.48,37.79 19.3,37.79 B_PFET.2 20.64,40.01 21.59,40.96 v21.59,44.77 23.5,46.68 U10.3.3V_1 27.53,46.68 28.72,45.49 31.67,45.49 41.36,35.8 41.36,27.77 43.96,25.17 45.21,25.17 48.44,21.94 55.06,21.94 55.73,21.27 64.14,21.27 v65.41,20.01
  Bottom 0.406: v65.41,20.01 v65.41,11.12
  other vias: 1.14,13.65
  pour Bottom: -1.27,80.65 66.04,80.65 66.04,-1.65 -1.27,-1.65
BLUE_LED_SIG  (via drill 0.35)
  Top 0.406: v18.67,40.24 18.67,39.19 B_PFET.1
  Bottom 0.406: U10.24 19.32,44.78 19.22,44.78 18.66,44.22 18.66,43.42 18.67,43.41 v18.67,40.24
CANRX  (via drill 0.35)
  Top 0.406: v15.88,18.73 U10.23
  Bottom 0.406: U5.4 31.12,53.34 30.53,52.75 30.53,28.38 29.69,27.54 27.86,27.54 25.34,25.02 25.34,23.42 24.72,22.8 17.83,22.8 15.88,20.84 v15.88,18.73 | U10.23 4.06,23.18 v1.4,23.18
CANTX  (via drill 0.35)
  Top 0.406: U10.22 10.07,21.27 10.39,21.6 17.98,21.6 v18.03,21.66
  Bottom 0.406: U5.1 31.59,48.35 31.59,27.06 29.7,25.17 28.02,25.17 25.09,22.24 18.62,22.24 v18.03,21.66 | U10.22 5.71,24.07 v1.4,24.07
CIPO  (via drill 0.35)
  Top 0.406: v5.97,8.07 5.97,7.81 SPI2.2
  Bottom 0.406: U10.1 16.38,8.83 8,8.83 7.24,8.07 v5.97,8.07
COPI  (via drill 0.35)
  Top 0.406: v13.34,32.07 13.34,30.46 10.14,27.26 10.14,26.72 10.52,26.33 16.53,26.33 19.69,23.18 19.69,18.42 v17.14,15.88 | v6.6,8.83 4.44,8.83 SPI2.3
  Bottom 0.406: U10.26 23.75,53.91 14.2,44.37 14.2,39.97 14.22,39.94 14.22,32.96 v13.34,32.07 | v17.14,15.88 10.72,9.46 7.24,9.46 v6.6,8.83
CS1  (via drill 0.35)
  Top 0.406: v6.82,6.45 5.5,6.45 4.45,5.4 4.45,2.86 3.18,1.59 SPI2.1
  Bottom 0.406: v6.82,6.45 6.86,6.42 8.64,8.19 18.29,8.19 U10.0
FSR_HEEL_L
  Top 0.152: 20.16,76.74 C1.2
  Top 0.406: 20.16,76.74 23.16,73.74 R10.2 24.73,72.1 35.37,72.1 37.01,73.74 FSR_TRQ_L.4
  Bottom 0.406: U10.38 6.98,58.36 6.98,70.8 11.92,75.74 19.76,75.74 C1.2
FSR_HEEL_R  (via drill 0.35)
  Top 0.152: 8.66,8.74 8.68,8.76
  Top 0.406: U10.17 6.8,32.26 6.8,24.24 6.38,23.82 6.38,11.06 8.68,8.76 | v19.68,8.54 19.68,7.9 16.55,4.77 9.53,4.77 R9.2 | 8.66,8.74 13.29,8.74 15.29,10.74 15.66,10.74 C2.1 16.16,10.74 21.89,10.74 v21.93,10.78 22.56,10.78 23.29,10.05 35.29,10.05 43.74,1.59 53.98,1.59 59.59,7.2 61.06,7.2 FSR_TRQ_R.4
  Bottom 0.406: v21.93,10.78 v19.68,8.54
FSR_TOE_L
  Top 0.406: FSR_TRQ_L.3 36.1,78.22 35.66,78.42 14.61,78.42 R8.2 13.34,75.25 C19.2
  Bottom 0.152: C19.2 11.39,73.3
  Bottom 0.406: U10.39 9.83,55.62 9.83,68.57 11.39,70.12 11.39,73.3
FSR_TOE_R  (via drill 0.35)
  Top 0.406: U10.16 6.06,34.06 6.06,26.14 5.54,25.62 5.54,10.82 7.71,8.65 7.71,6.24 | 7.71,6.24 7.71,2.77 R7.2 | 7.71,6.24 8.4,6.24 C20.1 | FSR_TRQ_R.3 62.23,2.86 60.33,0.96 43.24,0.96 34.98,9.21 29.85,9.21 v29.21,8.58
  Bottom 0.406: v29.21,8.58 21.59,8.58 15.88,2.86 10.16,2.86 R7.2
GND  (via drill 0.35)
  Top 0.406: C18.2 39.05,68.27 40.32,66.99 44.7,66.99 v45.47,67.76
  Top 0.813: FSR_TRQ_R.7 78.03,2.86 XT30UPB-F2.- XT30UPB-F3.-
  Top 1.27: v78.34,42.55 XT30UPB-F4.- 81.91,46.12
  Bottom 0.152: U10.GND1 23.81,11.05 | 48.75,46.19 C15.2
  Bottom 0.406: INA219.2 53.02,38.87 | 53.02,38.87 INA219.1 | 53.02,38.87 51.94,39.96 49.42,39.96 48.58,39.11 C3.1 | U3.3 46.74,75.88 46.1,75.25 v45.34,75.25 42.44,75.25 42.23,75.04 42.23,74.19 42.44,73.98 43.04,73.98 U3.12 | INA219.6 51.12,45.1 v50.03,46.19 48.75,46.19 | C17.2 25.78,9.85 v22.23,9.85 | C23.1 v1.14,16.2 | v10.67,14.67 v12.45,16.45 | C4.1 64.14,24.45 60.96,21.27 60.96,19.37 58.74,17.15 U4.12 | 23.81,11.05 C17.2 | v60.96,13.02 61.28,12.7 U4.3 | U5.2 34.61,50.8 v35.56,49.85 35.88,49.53 U5.8 | C17.2 27.05,11.12 29.85,11.12 31.75,13.02 41.63,13.02 43.81,10.84 v43.81,10.48 45.09,9.21 C11.2
  Bottom 1.27: 81.91,46.12 81.91,41.04 71.36,30.48 C4.1 | C16.- v78.34,42.55
  other vias: 37.47,60.65
  pour Top: -0.7,80.01 66.04,80.01 66.04,-1.01 -0.7,-1.01
  pour Bottom: 74.3,79.69 74.3,-0.95 90.81,-0.95 90.81,79.69
GREEN_LED_SIG  (via drill 0.35)
  Top 0.406: v14.86,40.24 14.86,39.19 G_PFET.1
  Bottom 0.406: U10.25 16.65,44.66 15.54,44.66 14.86,43.98 v14.86,40.24
L7_VIN
  Top 1.27: D1.C 62.52,39.66 SHUNT.1 | 62.55,35.64 64.06,35.64 C4.2 | D1.C 62.55,35.64 | 62.55,35.64 59.87,32.96 U$11.1 | R1.2 60.33,39.69 D1.C
  Bottom 1.27: C4.2 66.04,37.47 C16.+
N$1
  Top 0.406: RGB_LED.1 3.49,73.15 5.93,70.71 5.93,63.14 8.11,60.96 12.64,60.96 R4.2
N$2
  Top 0.406: B_PFET.3 19.62,41.59 R4.1
N$15
  Bottom 0.152: U4.5 U4.4
  Bottom 0.406: U4.13 U4.4
N$16
  Bottom 0.406: R13.1 51.44,5.4 54.93,8.89 U4.8
N$17
  Top 0.406: S_P_FET.3 R3.2
N$18
  Bottom 0.406: R3.1 3.49,58.37 SYNC_LED.2
N$23
  Top 0.406: C9.1 58.1,50.9 57.14,49.93 57.14,46.03 R2.1
  Bottom 0.406: INA219.8 53.79,44.45 R2.1
N$24
  Top 0.406: RGB_LED.4 3.49,62.81 4.81,61.49 4.81,57.58 7.07,55.32 10.47,55.32 R6.2
N$25
  Top 0.406: RGB_LED.2 3.49,70.61 5.37,68.73 5.37,57.81 7.31,55.88 13.91,55.88 R5.2
N$26
  Bottom 0.406: C9.2 R1.1 55.89,45.42 53.24,45.42 53.02,45.2 53.02,44.95 INA219.7
N$27
  Bottom 0.406: U4.9 54.93,16.34 53.8,17.47 50.8,17.47 49.53,16.2 R13.2
N$28  (via drill 0.35)
  Top 0.406: C17.1 32.1,11.09 35.77,11.09 39.78,7.08 | FSR_TRQ_R.6 62.87,7.94 v58.42,7.94 52.7,2.23 44.64,2.23 39.78,7.08 | 39.78,7.08 42.32,7.08 v42.55,7.3
  Bottom 0.406: U4.6 57.47,8.89 v58.42,7.94
N$29  (via drill 0.35)
  Top 0.305: 43.18,7.94 43.18,6.04
  Top 0.406: 43.18,7.94 v42.55,8.58 | 43.18,6.04 45.72,3.5 51.44,3.5 C11.1 v56.52,8.58 58.12,8.58 58.15,8.6 64.04,8.6 67.24,5.4 FSR_TRQ_R.8
  Bottom 0.406: v56.52,8.58 56.2,8.89 U4.7
N$30
  Top 0.406: G_PFET.3 15.88,43.63 R5.1
N$31
  Top 0.406: R_PFET.3 R6.1
N$32
  Bottom 0.406: U3.5 U3.4 48.4,74.59 44.18,74.59 44.16,74.61 U3.13
N$33  (via drill 0.35)
  Top 0.152: 50.23,72.74 v50.42,72.71
  Top 0.406: 50.23,72.74 42.42,72.74 41.76,72.07 v36.83,72.07
  Bottom 0.406: v36.83,72.07 FSR_TRQ_L.6 | v50.42,72.71 51.69,71.44 51.69,69.92 C22.1 49.53,72.07 U3.6 v46.36,72.07
N$34  (via drill 0.35)
  Top 0.406: v32.38,71.44 33.66,70.17 45.09,70.17 47.62,67.63 51.44,67.63 C21.1
  Bottom 0.406: FSR_TRQ_L.8 v32.38,71.44 | C21.1 49.85,69.22 49.85,69.96 49.64,70.17 49.04,70.17 U3.7 v46.36,70.8
N$35
  Bottom 0.406: U3.9 43.67,68.27 40.5,65.09 R15.2
N$36
  Bottom 0.406: U3.8 48.4,65.27 R15.1
N$44  (via drill 0.35)
  Top 0.406: v54.29,68.9 54.09,69.1 CAN_L1.1 | v46.36,14.29 46.36,13.75 46.34,13.74 46.34,8.43 45.86,7.94 44.32,7.94 v43.81,8.45 | v35.56,7.3 34.29,8.58 33.09,8.58 31.59,7.07 31.59,6.52 CAN_R0.1 30.73,6.69 24.4,6.69 23.81,7.28 22.91,7.28 22.7,7.07 22.7,6.52 CAN_R1.1 | R12.2 48.9,20.01 62.87,20.01 63.97,18.91 65.87,18.91 66.67,19.7 66.67,63.81 65.42,65.06 65.42,70.17 | CAN_L0.1 65.88,73.43 65.88,72.88 65.42,72.42 65.42,70.17 | 65.42,70.17 63.51,72.07 v62.87,72.07
  Bottom 0.406: v46.36,14.29 46.36,17.47 R12.2 | v62.87,72.07 55.84,72.07 54.29,70.53 v54.29,68.9 54.29,66.99 42.23,54.93 42.23,52.96 40.07,50.8 U5.7 38.33,50.19 38.8,50.19 39.37,49.62 39.37,44.77 R11.2 | v43.81,8.45 42.55,9.72 39.76,9.72 37.35,7.3 v35.56,7.3
N$45  (via drill 0.35)
  Top 0.406: v53.34,68.9 53.34,73.53 CAN_L1.2 | v68.16,62.76 68.16,19.86 66.01,17.71 63.1,17.71 62.08,18.73 R12.1 49.68,18.73 47.62,16.68 47.62,7.94 46.99,7.3 v43.81,7.3 | v28.58,6.04 23.5,6.04 CAN_R1.2 | v33.02,7.3 32.25,6.54 CAN_R0.2 | CAN_L0.2 65.06,73.78 65,73.72 63.81,73.72 v63.37,73.28
  Bottom 0.305: 53.34,71.44 53.34,69.52
  Bottom 0.406: v68.16,62.76 68.16,64.46 67.3,65.32 67.3,69.55 63.56,73.28 v63.37,73.28 63.31,73.34 55.25,73.34 53.34,71.44 v53.34,68.9 | v53.34,68.9 53.34,66.99 40.64,54.3 R11.1 39.05,52.07 U5.6 | 53.34,69.52 v53.34,68.9 | v43.81,7.3 43.61,7.3 41.4,5.1 36.5,5.1 34.29,7.3 v33.02,7.3 32.38,7.94 30.48,7.94 v28.58,6.04
NANO_RX
  Top 0.406: USB.B2 25.4,53.02 22.23,53.02 21.59,53.66 21.59,56.84 13.97,64.45 U10.35
NANO_TX
  Top 0.406: U10.34 18.41,66.99 22.23,63.18 24.77,63.18 30.8,57.15 30.8,53.64 29.21,52.04 USB.B1
RED_LED_SIG
  Top 0.406: U10.14 10.98,39.12 R_PFET.1
RESET
  Top 0.406: USB.A13 30.89,46.68 29.54,48.03 26.74,48.03 24.6,50.17 21.61,50.17 13.98,57.79 13.19,57.79 12.24,56.84 U10.ON/OFF
  Bottom 0.406: RESET.1 2.1,47.75 7.68,53.34 8.91,53.34 10.59,55.03 10.59,56.38 U10.ON/OFF
SCK1  (via drill 0.35)
  Top 0.406: v13.34,34.61 9.53,30.8 9.53,26.54 10.29,25.77 16.28,25.77 19.13,22.93 19.13,19.32 v15.75,15.94 | v5.78,9.48 5.68,9.38 3.96,9.38 3.78,9.21 SPI2.4
  Bottom 0.406: U10.27 20.32,56.84 15.88,52.39 15.88,46.83 13.64,44.6 13.64,39.73 13.67,39.71 13.67,34.94 v13.34,34.61 | v15.75,15.94 9.83,10.02 7.01,10.02 6.47,9.48 v5.78,9.48
SCL0  (via drill 0.35)
  Top 0.406: USB.A9 47.62,33.34 47.62,26.99 48.39,26.23 52.83,26.23 55.25,23.81 v64.77,23.81 | NANO_I2C.2 81.91,23.81 v71.12,23.81
  Bottom 0.406: USB.A9 48.26,36.52 49.85,38.1 INA219.4 | v71.12,23.81 v64.77,23.81
SCL_TEENSY
  Bottom 0.406: TEENSY_I2C.2 7.87,29.53 U10.19
SDA0  (via drill 0.35)
  Top 0.406: v64.66,22.02 55.77,22.02 52.76,25.03 48.16,25.03 46.43,26.76 46.43,31.99 USB.A8 | NANO_I2C.1 81.28,21.91 v71.12,21.91
  Bottom 0.406: INA219.3 51.12,38.1 46.99,33.98 USB.A8 | v71.12,21.91 71.01,22.02 v64.66,22.02
SDA_TEENSY
  Bottom 0.406: TEENSY_I2C.1 7.87,32.07 U10.18
STOP
  Bottom 0.406: STOP.1 3.18,17.59 9.65,17.59 12.07,20.01 12.07,25.72 22.86,36.52 U10.9
SYNC_DEFAULT  (via drill 0.35)
  Top 0.406: v11.43,26.99 23.11,26.99 U10.5
  Bottom 0.406: v11.43,26.99 9.23,26.99 8.91,27.31 5.4,27.31 SYNC_DEFAULT.1
SYNC_SIG
  Top 0.406: U10.15 5.78,39.05 4.99,38.27 3.4,38.27 S_P_FET.1
TRQ_AMP_L1  (via drill 0.35)
  Top 0.406: C18.1 44.96,68.27 v45.47,68.77 | v18.03,51.76 U10.40 | v40.01,66.36 38.1,66.36 36.83,65.09 | 36.83,65.09 v34.93,63.18 | 36.83,65.09 36.83,62.55 v37.47,61.91
  Bottom 0.406: U3.11 U3.10 42.86,70.8 41.59,69.53 C18.1 41.59,67.95 v40.01,66.36 | v18.03,51.76 19.29,53.01 20.02,53.01 22.89,55.88 26.05,55.88 29.06,58.89 30.63,58.89 v34.93,63.18
TRQ_AMP_R1  (via drill 0.35)
  Top 0.406: v52.7,21.17 48.26,21.17 47.18,20.09 28.72,20.09 28.02,20.78 28.02,21.55 24.48,25.09 v20.32,25.09 | U10.20 9.78,25.09 v14.61,25.09
  Bottom 0.406: U4.10 U4.11 | U4.10 56.2,19.58 54.61,21.17 v52.7,21.17 | v14.61,25.09 v20.32,25.09 | v43.81,9.46 45.09,8.19 52.96,8.19 53.98,9.21 53.98,14.92 | 53.98,14.92 C10.1 | U4.10 55.56,15.06 55.56,14.46 55.35,14.25 54.5,14.25 54.29,14.46 54.29,14.61 53.98,14.92
VCC1  (via drill 0.6)
  Top 0.406: SHUNT.2 52.68,44.8 52.7,44.77
  Top 1.27: 52.7,44.77 55.56,47.63 R2.2
  Bottom 1.27: R2.2 55.56,54.71 59.45,58.6 63.31,58.6 66.97,54.93 v75.56,54.93 XT30UPB-F4.+
  pour Top: 74.3,79.69 74.3,-0.31 90.17,-0.31 90.17,79.69
VIN
  Top 1.27: C15.1 46.99,49.85 46.99,45.72 C3.2 46.99,42.55 46.99,38.67 48,37.66 49.66,37.66 53.34,33.98 C5.1 50.17,29.21 U$6.1
  Bottom 1.27: C3.2 48.76,44.32 INA219.5 | C5.1 55.49,30.24 55.49,29.78 57.02,28.25 U$11.3
VIN_PF  (via drill 0.35)
  Top 0.813: U$6.2 48.23,23.27 v46.07,25.43 | U10.VIN v14.06,11.12
  Bottom 0.4: 27.94,22.55 28.03,22.63 30.57,22.63 30.8,22.86
  Bottom 0.406: 30.8,22.86 31.75,23.81 | v46.07,25.43 45.64,25.87 45.64,26.85 44.94,27.54 43.64,27.54
  Bottom 0.813: USB.A15 42.55,49.85 42.55,43.56 | 42.55,43.56 32.9,33.92 32.9,24.96 31.75,23.81 | 27.94,22.55 26.35,20.96 25.36,19.96 22.91,19.96 v14.06,11.12 | C23.2 U10.VIN | FAN.1 6.41,2.39 4.92,3.89 4.92,10.52 C23.2 | v1.14,11.12 C23.2 | 42.55,43.56 42.55,28.64 43.64,27.54

### Text on the board
tPlace: AK Board V0.5.1 / Teensy 4.1
tDocu: Updates to make: | 1. Test with multiple motors running to make sure the sensors still work. | 2. Pull up on reset | 3. Remove SPI, replace with Serial and I2C between boards | 5. Heatsink/vias on power componenets.
_tsilk: FSR_HEEL_L | GND | L1_TRQ+ | L1_TRQ- | GND | TRQ_AMP_L1 | - | GND | + | P_CHANNEL | P_CHANNEL | P_CHANNEL | P_CHANNEL | CAN_TX | CAN_RX | GND | JLCJLCJLCJLC | 3.3V | 5v | GND | SCK1 | R1_TRQ- | TRQ_AMP_R1 | CAN_H | R1_TRQ+ | CAN_L | COPI1 | CIPO1 | FSR_TOE_R | CS1
_bsilk: P_CHANNEL | P_CHANNEL | P_CHANNEL | N_CHANNEL | N_CHANNEL | P_CHANNEL